# Altium schematic sheet 02_CAN.SchDoc
size A; SheetNumber: 5; SheetTotal: 5; SPICEModelCacheXKDQVVEG: <root> / <DocumentId>XKDQVVEG</DocumentId> / <CacheFrame Number="0"> / <Model Name="ewk105c6104_phf" Kind="CKT"> / <Text>* EWK105C6104_PHF     SPICE MODEL  ( General Type ) / *-------------------------------------------------------------------------------------------------------- / * Model Generated by TAIYO YUDEN Corporation (http://www.ty-top.com) / * Version 1.0 / * TAIYO YUDEN Control No. 170508_130520 / * Copyright(c) 2013 TAIYO YUDEN CO.,LTD. All Rights Reserved. / *-------------------------------------------------------------------------------------------------------- / * / * Products Name : Multilayer Ceramic Capacitors / * / * Characteristics : / *     Capacitance : 0.1 uF , Rated Voltage : 16V , TCC : X6S / *     Case Size : 0.52 x 1.0 / 0.02 x 0.039 [mm/inch] , Thickness : 0.3 / 0.012 [mm/inch] / *     (Conditions: Temperature = 25 degC , DC Bias Current/Voltage = 0A / 0V) / * / * Frequency Range : 30000Hz - 3GHz / * / * External Node Assignments : / * / *  1  o---| |---o  2 / * / *-------------------------------------------------------------------------------------------------------- / .SubCkt EWK105C6104_PHF 1 2 / **************************** / C0 1 110 0.093945u / Cm 1 101 4015.5p / C1 101 102 6907.6p / Rc1 101 102 230.37 / C2 102 103 7508.5p / Rc2 102 103 74.952 / C3 103 110 81.048p / Rc3 103 110 59.728 / C2m 1 301 2663.9p / C21 301 302 7378.7p / Rc21 301 302 5.1263k / C22 302 303 0.018069u / Rc22 302 303 1.8135k / C23 303 304 0.013292u / Rc23 303 304 126.5 / C24 304 305 4091.8p / Rc24 304 305 408.26 / C25 305 306 9025.2p / Rc25 305 306 166.82 / C26 306 307 3751.5p / Rc26 306 307 397.75 / C27 307 308 451.87p / Rc27 307 308 20.437 / C28 308 309 331.33p / Rc28 308 309 27.089 / C29 309 110 79.215p / Rc29 309 110 107.24 / Rp0 1 110 5G / L0 110 120 0.043241n / Lm 120 130 0.056635n / L1 120 121 0.54526p / RL1 121 130 0.48173 / L2 120 122 0.071657n / RL2 122 130 0.79137 / L3 120 123 0.12452n / RL3 123 130 1.2778 / CR 120 124 0.014267u / LR 124 125 0.031885n / RR 125 130 0.12021 / CL 130 140 38.272p / LL 130 140 0.039328n / RL 130 140 3.2412 / Rs 140 2 12.566m / **************************** / .ends EWK105C6104_PHF</Text> / </Model> / </CacheFrame> / </root>
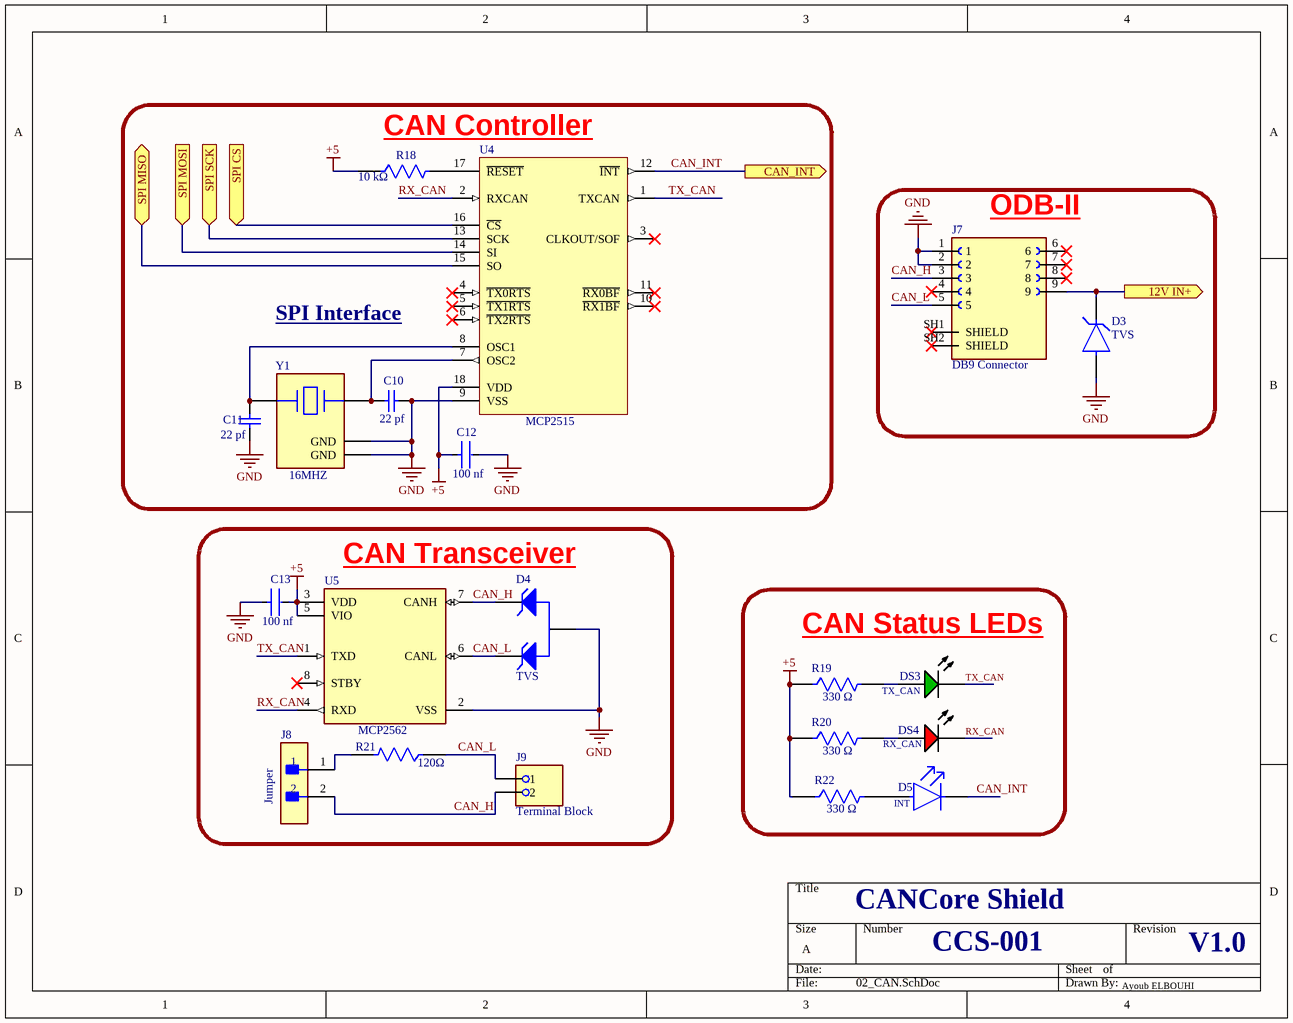
[diagram p0: 02_CAN.SchDoc]

## Parts
C10  22 pf  [CAPC1608X90X35ML15T15]
C11  22 pf  [CAPC1608X90X35ML15T15]
C12  100 nf  [FP-0204-L_0_52_0_05-W_1_0-IPC_B]
C13  100 nf  [FP-0204-L_0_52_0_05-W_1_0-IPC_B]
D3  TVS  [FP-SMBJ-MFG]
D4  TVS  [JSCJ-SOT23-3_V]
D5  INT  [FP-LTST-C170TBKT-MFG]
DS3  TX_CAN  [LTST-LTST-C170KGKT-2_V]
DS4  RX_CAN  [LTST-C170KRKT_V]
J7  DB9 Connector  [AMPHENOL_L77SDE09SA4CH4F48]
J8  Jumper  [FP-TSW-102-07-G-S-MFG]
J9  Terminal Block  [PHOENIX_1935161]
R18  10 kΩ  [FP-RC0603-0_55-IPC_C]
R19  330 Ω  [FP-RT0603-MFG]
R20  330 Ω  [FP-RT0603-MFG]
R21  120Ω  [FP-AT0603-IPC_A]
R22  330 Ω  [FP-RT0603-MFG]
U4  MCP2515  [SOIC-SO18_N]
U5  MCP2562  [FP-C04-057-SN-IPC_B]
Y1  16MHZ  [FP-ABM8G-MFG]

## Blocks framed on the sheet
CAN Controller: C10-C12 R18 U4 Y1
ODB-II: D3 J7
CAN Transceiver: C13 D4 J8 J9 R21 U5
CAN Status LEDs: D5 DS3 DS4 R19 R20 R22

## Ports
12V IN+ (out), CAN_INT (out), SPI CS (in), SPI MISO (bidir), SPI MOSI (in), SPI SCK (in)

## Nets
+5: C12.1 C13.2 R18.1 R19.1 R20.1 R22.1 U4.18(VDD) U5.3(VDD) U5.5(VIO)
GND: C10.1 C11.2 C12.2 C13.1 D3.2(A) D4.3(A) J7.1 J7.2 U4.9(VSS) U5.2(VSS) Y1.2(GND) Y1.4(GND)
12V IN+: D3.1(C) J7.9 ; port 12V IN+
CAN_H: D4.1(K) J7.3 J8.2 J9.2 U5.7(CANH)
CAN_INT: D5.1(C) U4.12(~{INT}) ; port CAN_INT
CAN_L: D4.2(K) J7.5 J9.1 R21.1 U5.6(CANL)
RX_CAN: DS4.2(K) U4.2(RXCAN) U5.4(RXD)
SPI CS: U4.16(~{CS}) ; port SPI CS
SPI MISO: U4.15(SO) ; port SPI MISO
SPI MOSI: U4.14(SI) ; port SPI MOSI
SPI SCK: U4.13(SCK) ; port SPI SCK
TX_CAN: DS3.1(K) U4.1(TXCAN) U5.1(TXD)
NetC10_2: C10.2 U4.7(OSC2) Y1.3
NetC11_1: C11.1 U4.8(OSC1) Y1.1
NetD5_2: D5.2(A) R22.2
NetDS3_2: DS3.2(A) R19.2
NetDS4_1: DS4.1(A) R20.2
NetJ8_1: J8.1 R21.2
NetR18_2: R18.2 U4.17(~{RESET})

Not connected (* = marked no-connect by the designer): J7 4* 6* 7* 8* SH1(SHIELD)* SH2(SHIELD)*; U4 3(CLKOUT/SOF)* 4(~{TX0RTS})* 5(~{TX1RTS})* 6(~{TX2RTS})* 10(~{RX1BF})* 11(~{RX0BF})*; U5 8(STBY)*

## Notes on the sheet
- SPI Interface
- CANCore Shield
- CCS-001
- V1.0
- Ayoub ELBOUHI

## Library data of the parts
C10 C11 = CMP-2006-04272-1: Manufacturer: AVX Interconnect / Elco; Part Number: 06035A220KAT2A
C12 C13 = CMP-14477-003485-2: None; Voltage Rating: 16V; Tolerance: 20%; Capacitance: 100nF; Packaging: Tape and Reel; Mount: Surface Mount; Ratings: AEC-Q200; Case/Package: 0204; Case Code (Imperial): 0204; Case Code (Metric): 0610; RoHS Compliant: Yes; Max Operating Temperature: 105°C; Min Operating Temperature: -55°C
D3 = CMP-07401-000035-1: TVS DIODE 24V 38.9V SMB; Max Breakdown Voltage: 30.7V; Operating Supply Voltage: 3.5V; Min Breakdown Voltage: 26.7V; Test Current: 1mA; Direction: Unidirectional; Peak Pulse Current: 15.4A; Peak Pulse Power: 600W; Number of Unidirectional Channels: 1; Element Configuration: Single; Power Line Protection: No; Diode Type: ZENER; Leakage Current: 5uA; Max Surge Current: 100A; ESD Protection: Yes; Width: 3.94mm; Number of Pins: 2; Clamping Voltage: 38.9V; Reverse Standoff Voltage: 24V; Breakdown Voltage: 30.7V; RoHS Compliant: Yes; Package Quantity: 1; Case/Package: SMB; Mount: Surface Mount; Resistor Type: Zener; Packaging: Tape and Reel; Reverse Breakdown Voltage: 26.7V; Series: SMBJ; Radiation Hardening: No; Max Operating Temperature: 150°C; Termination: SMD/SMT; Number of Channels: 1; Length: 4.57mm; REACH SVHC: No SVHC; Number of Elements: 1; Polarity: Unidirectional; Height: 2.42mm; Max Power Dissipation: 600W; Max Reverse Leakage Current: 5uA; Min Operating Temperature: -55°C
D4 = CMP-2100-03607-1: Uni-direction ESD Protection Diode, 5 V, 10 uA, 3-Pin SOT23, RoHS, Tape and Reel; Manufacturer: Jiangsu Changjiang Electronics Technology; Package Version: Rev. E, 09/2009; Package URL: http://www.cj-elec.com/gallery/txUpfile/201412381536055.pdf; Package Reference: SOT23-3; Datasheet Version: Rev. C, 04/2014; Datasheet URL: http://www.cj-elec.com/gallery/txUpfile/c44551eb678d297ed58d78171eee05d7.pdf; Package Description: 3-Pin Small Outline Transistor, Body 2.9 x 1.3 mm, Pitch 0.95 mm
D5 = CMP-22017-000023-1: LED BLUE CLEAR SMD; Luminous Intensity: 180mcd; Number of LEDs: 1; Lens Style: Diffused; Power Rating: 76mW; Lens Color: Colorless; Forward Voltage: 3.8V; Viewing Angle: 130°; Reverse Voltage: 5V; Forward Current: 20mA; Dominant Wavelength: 475nm; Wavelength: 468nm; Radiation Hardening: No; Illumination Color: Blue; Case Code (Metric): 2012; Max Operating Temperature: 80°C; Case Code (Imperial): 0805; Min Operating Temperature: -20°C; Height: 1.1mm; Color: Blue; Package Quantity: 1; Lens Transparency: Clear; Number of Pins: 2; Lead Free: Lead Free; Mount: Surface Mount; Length: 2mm; Depth: 1.25mm; Number of Elements: 1; Case/Package: 0805; Power Dissipation: 76mW; Width: 1.25mm; Test Current: 20mA; Packaging: Tape and Reel
DS3 = CMP-2000-06620-1: Ultra Bright AlInGaP Chip LED, 75 mW, -55 to 85 degC, 2-Pin SMD (0805), RoHS, Tape and Reel; Manufacturer: Lite-On; Forward Current: 30mA; Power Dissipation Max: 75mW; Emitting Color: YellowGreen; Type: Uni-Color; Forward Voltage: 2.4V; Dominant Wave Length: 571nm; Test Current (It): 20mA; Product Length (mm): 2mm; Peak Wavelength: 574nm; Power Dissipation: 75W; Product Depth (mm): 1.25mm; DELETED: Compliant; High Brightness: Yes; Product Height (mm): 1.1mm; Luminous Intensity: 35mcd; Shape Type: Rectangular; Chip Material: AlGaInP; Viewing Angle: 130deg; Number of  Elements: 1; Reverse Voltage: 5V; Rad Hardened: No; Package Type: ChipLed; Manufacturer URL: http://www.us.liteon.com/; Mounting: SurfaceMount; Operating Temp Range: -55Cto85C; Datasheet URL: http://optoelectronics.liteon.com/upload/download/DS22-2000-073/S_110_LTST-C170KGKT.pdf; Packaging: TapeandReel; Pin Count: 2; Package Description: 2-Pin Surface Mounted Device, Body 2 x 1.25 mm; Mounting Technology: SurfaceMount; Package Reference: LTST-C170KGKT-2; Forward Current Max: 30mA; Datasheet Version: Rev. G, 06/2005; Lens Dimensions: 1.4x1.25x0.6mm; Operating Temperature Classification: Industrial; Lum Intensity: 35mcd; Main Category: ChipLED
DS4 = CMP-2000-07593-1: LED Red, 75 mW, 54 mcd, -55 to 85 degC, 2-Pin SMD, RoHS, Tape and Reel; Manufacturer: Lite-On; Lens Transparency: Clear; Number of Elements: 1; Power Rating: 75mW; Luminous Intensity: 54mcd; Viewing Angle: 130degrees; Forward Current: 30mA; Wavelength: 639nm; Lens Style: Rectangular; Case\/Package: 0805; Test Current: 20mA; Dominant Wavelength: 631nm; Forward Voltage: 2V; Lens Colour: Colorless; Min Operating Temperature: -55degC; RoHSCompliant: True; Length: 3.2mm; Width: 1.25mm; Mount: SurfaceMount; Packaging: TapeandReel; Number of LEDs: 1; Radiation Hardening: No; Datasheet URL: http://optoelectronics.liteon.com/upload/download/DS-22-99-0150/LTST-C170KRKT.pdf; Datasheet Version: Rev. D, 11/2014; Case Code (Metric): 2012; Height: 1.1mm; Number of Pins: 2; Package Description: 2-Pin Surface Mount Device, Body 2 x 1.25 mm; Manufacturer URL: http://www.us.liteon.com/; Lead Free: LeadFree; Illumination Colour: Red; Colour: Red; Case Code (Imperial): 0805; Max Operating Temperature: 85degC; Power Dissipation: 75mW; Mounting Technology: SurfaceMount; Package Reference: C170KRKT; Package Quantity: 1; Depth: 1.6mm
J7 = L77SDE09SA4CH4F48: Dsub, Stamped Signal 3A, Right Angle PCB Through Hole, FP=8.08mm (0.318in), Row Pitch 2.84mm, 9 Socket, Flash Gold, Bright Tin Shell, 4-40 Removable Front Screwlock (Hex Height 4.8mm), Ground Tab with Boardlock; MF: Amphenol ICC (Commercial Products); SnapEDA_Link: https://www.snapeda.com/parts/L77SDE09SA4CH4F48/Amphenol/view-part/?ref=snap; Package: None; Value: *; MP: L77SDE09SA4CH4F48; Check_prices: https://www.snapeda.com/parts/L77SDE09SA4CH4F48/Amphenol/view-part/?ref=eda
J8 = CMP-02766-000084-1: CONN HEADER VERT 2POS 2.54MM; Manufacturer: Samtec; Manufacturer Part Number: TSW-102-07-G-S; Number Of Contacts: 2; Voltage Rating: 550V; Conn Orientation: Straight; Current Rating: 6.3A; Conn Gender: Male; Package: TSW-102-07-G-S; Digikey Description: CONN HEADER VERT 2POS 2.54MM; ComponentLink2URL: http://suddendocs.samtec.com/catalog_english/tsw_th.pdf; Height: 8.71mm; Temperature: -55°C to +125°C; Device Class L2: Headers and Wire Housings; ComponentLink2Description: Datasheet; Device Class L3: unset; Contact Material: Gold,Nickel; Temperature Range Low: -55°C; Temperature Range High: +125°C; RoHS: TRUE; Device Class L1: Connectors; Mouser Description: Conn Unshrouded Header HDR 2 POS 2.54mm Solder ST Thru-Hole Automotive Bulk; Number Of Rows: 1; Category: Conn; Pitch: 2.54mm; Lead Free: Yes; Automotive: No; Footprint Url: http://suddendocs.samtec.com/prints/tsw-xxx-xx-x-x-xx-xxx-footprint.pdf; Octopart: https://octopart.com/tsw-102-07-g-s-samtec-272197
J9 = 1935161: PCB Terminal Screw 5mm 16AWG 400V 17.5A 2 Position COMBICON PT Series | Phoenix Contact 1935161; SnapEDA_Link: https://www.snapeda.com/parts/1935161/Phoenix+Contact/view-part/?ref=snap; Package: None; Value: *; MF: Phoenix Contact; MP: 1935161; Check_prices: https://www.snapeda.com/parts/1935161/Phoenix+Contact/view-part/?ref=eda
R18 = CMP-2100-03664-2: RES 10K OHM 1% 1/10W 0603; Voltage Rating: 75V; Voltage Rating (DC): 50V; Resistance: 10kR; Power Rating: 100mW; Temperature Coefficient: 100ppm/°C; Depth: 0.8mm; Termination: SMD/SMT; Resistor Type: Thick Film; Series: RC; Construction: Rectangular; Features: Moisture Resistant; Packaging: Tape and Reel; Min Operating Temperature: -55°C; Number of Terminations: 2; Lead Pitch: 0.3mm; RoHS Compliant: Yes; Case/Package: 0603; Resistance Tolerance: 1%; Military Standard: Not; Weight: 7.1E-05oz; Number of Pins: 2; Tolerance: 1%; Length: 1.6mm; Case Code (Imperial): 0603; Lead Free: Lead Free; Width: 0.8mm; Max Power Dissipation: 100mW; Height: 0.45mm; Max Operating Temperature: 155°C; Case Code (Metric): 1608; Size Code: 0603
R19 R20 R22 = CMP-03412-025644-1: RES SMD 330 OHM 1% 1/10W 0603; Manufacturer: Yageo; Manufacturer Part Number: RT0603FRD07330RL; Resistance: 330Ω; Tolerance: 0.01; Power Rating: 0.1W; Temperature Coefficient: 25 ppm/°C; Voltage Rating: 75V; Value: 330Ω; Octopart: https://octopart.com/rt0603frd07330rl-yageo-71395358; Temperature: -55°C to +155°C; Height: 0.55mm; Temperature Range Low: -55°C; Category: Res; Ipc Land Pattern Name: RESC16080X45; Device Class L1: Passive Components; ComponentLink2Description: Datasheet; Temperature Range High: +155°C; RoHS: TRUE; Footprint Url: http://www.yageo.com/exep/pages/download/literatures/PYu-R_Mount_10.pdf; ComponentLink2URL: http://www.yageo.com/documents/recent/PYu-RT_1-to-0.01_RoHS_L_9.pdf; Automotive: No; Device Class L3: Chip SMD Resistors; Series: RT; Composition: Thin Film; Device Class L2: Resistors; Digikey Description: RES SMD 330 OHM 1% 1/10W 0603; Package: RT0603; Lead Free: Yes
R21 = CMP-03412-046015-1: Thin Film Chip Resistors Automotive Grade 120Ω 1% 50ppm/°C 0603; RoHS Compliant: Yes
U4 = CMP-0186-00137-2: Stand-Alone CAN Controller With SPI Interface, 18-Pin SOIC, Extended Temperature, Tape and Reel; RevisionNote: URLs added. DatasheetVersion updated.; PackageDescription: 18-Lead Plastic Small Outline (SO) - Wide 7.50mm Body [SOIC]; Code_JEDEC: MS-013; PackageReference: SOIC-SO18; PackageVersion: revBB, Aug-2009; ComponentLink2URL: http://ww1.microchip.com/downloads/en/DeviceDoc/21801f.pdf; DatasheetVersion: revF, Oct-2010; ComponentLink3Description: Package Specification; ComponentLink2Description: Datasheet; ComponentLink1Description: Manufacturer URL; ComponentLink3URL: http://www.microchip.com/stellent/groups/techpub_sg/documents/packagingspec/en012702.pdf; ComponentLink1URL: http://www.microchip.com/
U5 = CMP-06279-000005-1: IC TRANSCEIVER 1/1 8SOIC; Operating Supply Current: 70mA; Data Rate: 8Mbps; Number of Transceivers: 1; Receiver Hysteresis: 200mV; Max Supply Voltage: 5.5V; Min Supply Voltage: 4.5V; Weight: 0.019048oz; Package Quantity: 3300; Case/Package: SOIC; Mount: Surface Mount; Max Operating Temperature: 125°C; Min Operating Temperature: -40°C; Packaging: Tape and Reel; Number of Pins: 8
Y1 = CMP-27762-006537-2: Crystal 16MHz ±20ppm (Tol) ±30ppm (Stability) 18pF FUND 80Ω 4-Pin SMD T/R; Series Resistance: 80R; Radiation Hardening: No; Load Capacitance: 18pF; Package Quantity: 1000; Frequency Stability: 30ppm; ESR (Equivalent Series Resistance): 80R; Depth: 2.5mm; Height: 1mm; Number of Pins: 4; Frequency Tolerance: 20ppm; Frequency: 16MHz; Tolerance: 20ppm; Min Operating Temperature: -40°C; Length: 3.2mm; Termination: SMD/SMT; Max Operating Temperature: 85°C; Width: 2.5mm; Series: ABM8G; Mount: Surface Mount; Case/Package: CSMD; Lead Free: Lead Free; Operating Frequency: 16 MHz; Packaging: Tape and Reel